# Altium schematic sheet power.SchDoc
size A4; SheetNumber: 4; SheetTotal: 5
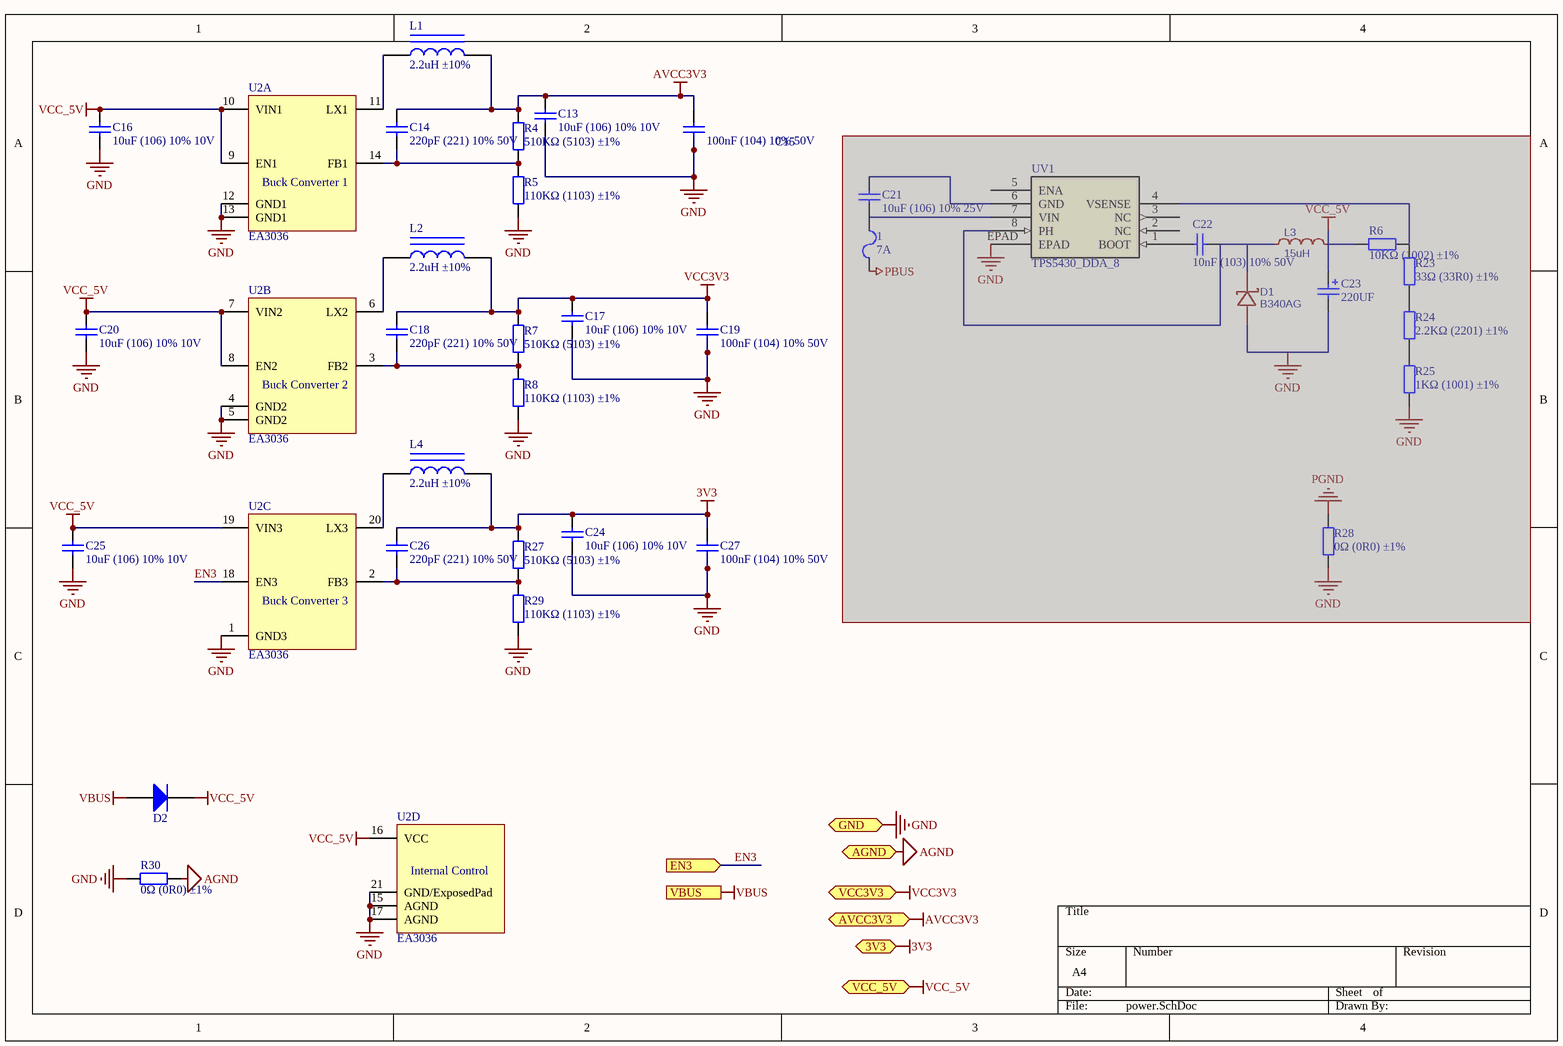
[diagram p0: power.SchDoc]

## Parts
1  7A  [2512]  (masked out: inside a compile mask, not in the netlist)
C13  10uF (106) 10% 10V  [LC-0603_C]
C14  220pF (221) 10% 50V  [LC-0603_C]
C15  100nF (104) 10% 50V  [LC-0603_C]
C16  10uF (106) 10% 10V  [LC-0603_C]
C17  10uF (106) 10% 10V  [LC-0603_C]
C18  220pF (221) 10% 50V  [LC-0603_C]
C19  100nF (104) 10% 50V  [LC-0603_C]
C20  10uF (106) 10% 10V  [LC-0603_C]
C21  10uF (106) 10% 25V  [LC-0805_C]  (masked out: inside a compile mask, not in the netlist)
C22  10nF (103) 10% 50V  [LC-0603_C]  (masked out: inside a compile mask, not in the netlist)
C23  220UF  [SMD,6.3x7.7mm]  (masked out: inside a compile mask, not in the netlist)
C24  10uF (106) 10% 10V  [LC-0603_C]
C25  10uF (106) 10% 10V  [LC-0603_C]
C26  220pF (221) 10% 50V  [LC-0603_C]
C27  100nF (104) 10% 50V  [LC-0603_C]
D1  B340AG  [SMA_L4.4-W2.6-LS5.0-RD]  (masked out: inside a compile mask, not in the netlist)
D2  二极管-5819W  [SOD-323]  (value not drawn)
L1  2.2uH ±10%  [LC-0805_L]
L2  2.2uH ±10%  [LC-0805_L]
L3  15uH  [电感]  (masked out: inside a compile mask, not in the netlist)
L4  2.2uH ±10%  [LC-0805_L]
R4  510KΩ (5103) ±1%  [LC-0603_R]
R5  110KΩ (1103) ±1%  [LC-0603_R]
R6  10KΩ (1002) ±1%  [LC-0805_R]  (masked out: inside a compile mask, not in the netlist)
R7  510KΩ (5103) ±1%  [LC-0603_R]
R8  110KΩ (1103) ±1%  [LC-0603_R]
R23  33Ω (33R0) ±1%  [LC-0805_R]  (masked out: inside a compile mask, not in the netlist)
R24  2.2KΩ (2201) ±1%  [LC-0805_R]  (masked out: inside a compile mask, not in the netlist)
R25  1KΩ (1001) ±1%  [LC-0805_R]  (masked out: inside a compile mask, not in the netlist)
R27  510KΩ (5103) ±1%  [LC-0603_R]
R28  0Ω (0R0) ±1%  [LC-0603_R]  (masked out: inside a compile mask, not in the netlist)
R29  110KΩ (1103) ±1%  [LC-0603_R]
R30  0Ω (0R0) ±1%  [LC-0603_R]
U2  EA3036  [QFN-20]  (parts A,B,C,D of 4)
UV1  TPS5430_DDA_8  [TPS5430]  (masked out: inside a compile mask, not in the netlist)

## Ports
3V3 (bidir), AGND (bidir), AVCC3V3 (bidir), EN3 (in), GND (bidir), VBUS (in), VCC3V3 (bidir), VCC_5V (bidir)

## Nets
3V3: C24.2 C26.2 C27.2 L4.2 R27.2 ; port 3V3
AGND: R30.1 ; port AGND
AVCC3V3: C13.2 C14.2 C15.2 L1.2 R4.2 ; port AVCC3V3
GND: C13.1 C15.1 C16.2 C17.1 C19.1 C20.2 C24.1 C25.2 C27.1 R5.1 R8.1 R29.1 R30.2 U2.1(GND3) U2.4(GND2) U2.5(GND2) U2.12(GND1) U2.13(GND1) U2.15(AGND) U2.17(AGND) U2.21(GND/ExposedPad) ; port GND
VBUS: D2.1(A) ; port VBUS
VCC3V3: C17.2 C18.2 C19.2 L2.2 R7.2 ; port VCC3V3
VCC_5V: C16.1 C20.1 C25.1 D2.2(K) U2.7(VIN2) U2.8(EN2) U2.9(EN1) U2.10(VIN1) U2.16(VCC) U2.19(VIN3) ; port VCC_5V
EN3: U2.18(EN3) ; port EN3
NetC14_1: C14.1 R4.1 R5.2 U2.14(FB1)
NetC18_1: C18.1 R7.1 R8.2 U2.3(FB2)
NetC26_1: C26.1 R27.1 R29.2 U2.2(FB3)
NetL1_1: L1.1 U2.11(LX1)
NetL2_1: L2.1 U2.6(LX2)
NetL4_1: L4.1 U2.20(LX3)

## Notes on the sheet
- (in symbol EA3036, part A) Buck Converter 1
- (in symbol EA3036, part B) Buck Converter 2
- (in symbol EA3036, part C) Buck Converter 3
- (in symbol EA3036, part D) Internal Control

## Library data of the parts
1 = Fuse
C13 C16 C17 C20 C24 C25 = 0603 10uF (106) 10% 10V: 贴片电容; ComponentLink1Description: 供应商链接; ComponentLink1URL: http://www.szlcsc.com/product/details_20411.html; Package: 0603; Supplier: LC; SuppliersPartNumber: C19702
C14 C18 C26 = 0603 220pF (221) 10% 50V: 贴片电容; ComponentLink1Description: 供应商链接; ComponentLink1URL: http://www.szlcsc.com/product/details_1955.html; Package: 0603; Supplier: LC; SuppliersPartNumber: C1603
C15 C19 C27 = 0603 100nF (104) 10% 50V: 贴片电容; ComponentLink1Description: 供应商链接; ComponentLink1URL: http://www.szlcsc.com/product/details_15331.html; Package: 0603; Supplier: LC; SuppliersPartNumber: C14663
C21 = 0805 10uF (106) 10% 25V: 贴片电容; ComponentLink1Description: 供应商链接; ComponentLink1URL: http://www.szlcsc.com/product/details_16532.html; Package: 0805; Supplier: LC; SuppliersPartNumber: C15850
C22 = 0603 10nF (103) 10% 50V: 贴片电容; ComponentLink1Description: 供应商链接; ComponentLink1URL: http://www.szlcsc.com/product/details_58143.html; Package: 0603; Supplier: LC; SuppliersPartNumber: C57112
C23 = C_RB-470UF/25V_5X10
D1 = B340AG: BOM_Manufacturer: Shikues; Contributor: LCSC; BOM_Supplier: LCSC; BOM_Supplier Part: C433997; BOM_Manufacturer Part: B340AG; BOM_JLCPCB Part Class: Extended Part; spicePre: D; spiceSymbolName: B340AG
D2 = 二极管-5819W: 40V
L1 L2 L4 = 0805 2.2uH 10%: 贴片电感; ComponentLink1Description: 供应商链接; ComponentLink1URL: http://www.szlcsc.com/product/details_1395.html; Package: 0805; Supplier: LC; SuppliersPartNumber: C1043
L3 = 15uH: BOM_Manufacturer: CENKER; BOM_Manufacturer Part: CKCS3012-15uH/M; nameAlias: Inductance; Contributor: LCSC; BOM_Supplier: LCSC; BOM_Supplier Part: C354559; BOM_JLCPCB Part Class: Extended Part; spicePre: L; spiceSymbolName: CKCS3012-15UH/M
R4 R7 R27 = 0603 510KΩ (5103) 1%: 贴片电阻; ComponentLink1Description: 供应商链接; ComponentLink1URL: http://www.szlcsc.com/product/details_23919.html; Package: 0603; Supplier: LC; SuppliersPartNumber: C23192
R5 R8 R29 = 0603 110KΩ (1103) 1%: 贴片电阻; ComponentLink1Description: 供应商链接; ComponentLink1URL: http://www.szlcsc.com/product/details_26548.html; Package: 0603; Supplier: LC; SuppliersPartNumber: C25805
R6 = 0805 10KΩ (1002) 1%: 贴片电阻; ComponentLink1Description: 供应商链接; ComponentLink1URL: http://www.szlcsc.com/product/details_18102.html; Package: 0805; Supplier: LC; SuppliersPartNumber: C17414
R23 = 0805 33Ω (33R0) 1%: 贴片电阻; ComponentLink1Description: 供应商链接; ComponentLink1URL: http://www.szlcsc.com/product/details_18322.html; Package: 0805; Supplier: LC; SuppliersPartNumber: C17634
R24 = 0805 2.2KΩ (2201) 1%: 贴片电阻; ComponentLink1Description: 供应商链接; ComponentLink1URL: http://www.szlcsc.com/product/details_18208.html; Package: 0805; Supplier: LC; SuppliersPartNumber: C17520
R25 = 0805 1KΩ (1001) 1%: 贴片电阻; ComponentLink1Description: 供应商链接; ComponentLink1URL: http://www.szlcsc.com/product/details_18201.html; Package: 0805; Supplier: LC; SuppliersPartNumber: C17513
R28 R30 = 0603 0Ω (0R0) 1%: 贴片电阻; ComponentLink1Description: 供应商链接; ComponentLink1URL: http://www.szlcsc.com/product/details_21903.html; Package: 0603; Supplier: LC; SuppliersPartNumber: C21189
U2 = EA3036: EA3036 is a 3CH power management IC for applications powered by one Li-Ion battery or a DC 5V adapter.
UV1 = TPS5430_DDA_8: Imported; Vendor: Texas Instruments; PACKAGE_DESIGNATOR: DDA; PIN_COUNT: 8; FAMILY_NAME: STEP-DOWN REGULATOR; INDUSTRY_STD_PKG_TYPE: SO PowerPAD; Manufacturer_Part_Number: tps5430_dda_8; GENERIC_PART_NUMBER: TPS5430; Manufacturer: Texas Instruments; Datasheet_URL: http://www.ti.com/lit/gpn/TPS5430; Value: Value; Type: Type; RefDes: RefDes